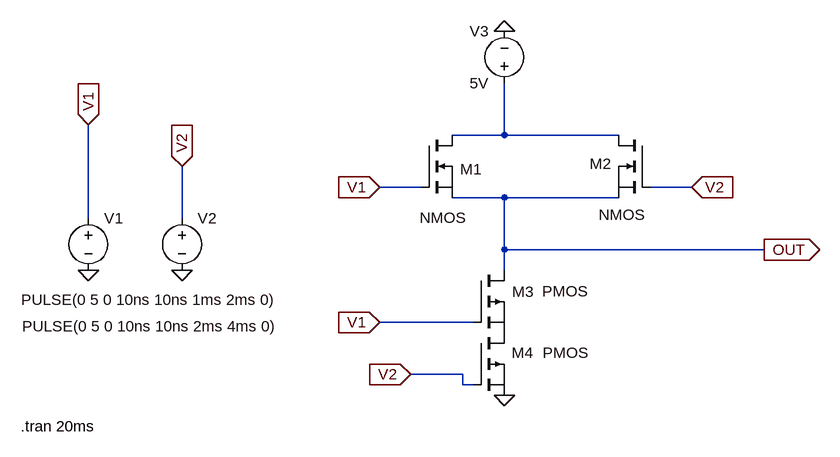
[diagram p0: schematic OR.asc]
OR.asc, the LTspice schematic file:
Version 4
SHEET 1 904 680
WIRE 368 192 368 112
WIRE 368 192 288 192
WIRE 544 192 368 192
WIRE 240 272 176 272
WIRE 656 272 592 272
WIRE 368 288 288 288
WIRE 544 288 368 288
WIRE -272 320 -272 176
WIRE -128 320 -128 240
WIRE 368 368 368 288
WIRE 768 368 368 368
WIRE 368 400 368 368
WIRE 320 480 176 480
WIRE 304 560 224 560
WIRE 304 576 304 560
WIRE 320 576 304 576
FLAG 368 592 0
FLAG 368 32 0
FLAG -128 400 0
FLAG -272 400 0
FLAG 768 368 OUT
IOPIN 768 368 Out
FLAG -272 176 V1
IOPIN -272 176 In
FLAG 176 272 V1
IOPIN 176 272 In
FLAG 176 480 V1
IOPIN 176 480 In
FLAG -128 240 V2
IOPIN -128 240 In
FLAG 224 560 V2
IOPIN 224 560 In
FLAG 656 272 V2
IOPIN 656 272 In
SYMBOL voltage -272 304 R0
WINDOW 3 -103 141 Left 2
WINDOW 123 0 0 Left 0
WINDOW 39 0 0 Left 0
SYMATTR Value PULSE(0 5 0 10ns 10ns 1ms 2ms 0)
SYMATTR InstName V1
SYMBOL voltage -128 304 R0
WINDOW 3 -246 182 Left 2
WINDOW 123 0 0 Left 0
WINDOW 39 0 0 Left 0
SYMATTR Value PULSE(0 5 0 10ns 10ns 2ms 4ms 0)
SYMATTR InstName V2
SYMBOL voltage 368 128 R180
WINDOW 0 24 96 Left 2
WINDOW 3 24 16 Left 2
WINDOW 123 0 0 Left 0
WINDOW 39 0 0 Left 0
SYMATTR InstName V3
SYMATTR Value 5V
SYMBOL pmos 320 496 R0
WINDOW 0 -20 -252 Left 2
WINDOW 3 107 31 Left 2
SYMATTR InstName M1
SYMBOL pmos 320 400 R0
WINDOW 0 179 -164 Left 2
WINDOW 3 106 32 Left 2
SYMATTR InstName M2
SYMBOL nmos 592 192 M0
WINDOW 0 178 241 Left 2
WINDOW 3 7 122 Left 2
SYMATTR InstName M3
SYMBOL nmos 240 192 R0
WINDOW 0 139 335 Left 2
WINDOW 3 -2 127 Left 2
SYMATTR InstName M4
TEXT -376 640 Left 2 !.tran 20ms

The netlist it stands for:
* OR.asc
V1 V1 0 PULSE(0 5 0 10ns 10ns 1ms 2ms 0)
V2 V2 0 PULSE(0 5 0 10ns 10ns 2ms 4ms 0)
V3 N001 0 5V
M1 P001 V2 0 0 PMOS
M2 OUT V1 P001 P001 PMOS
M3 N001 V2 OUT OUT NMOS
M4 N001 V1 OUT OUT NMOS
.model NMOS NMOS
.model PMOS PMOS
.lib standard.mos
.tran 20ms
.backanno
.end